# EAGLE schematic attiny_rc_switch_schematic (EAGLE 9.7.0)
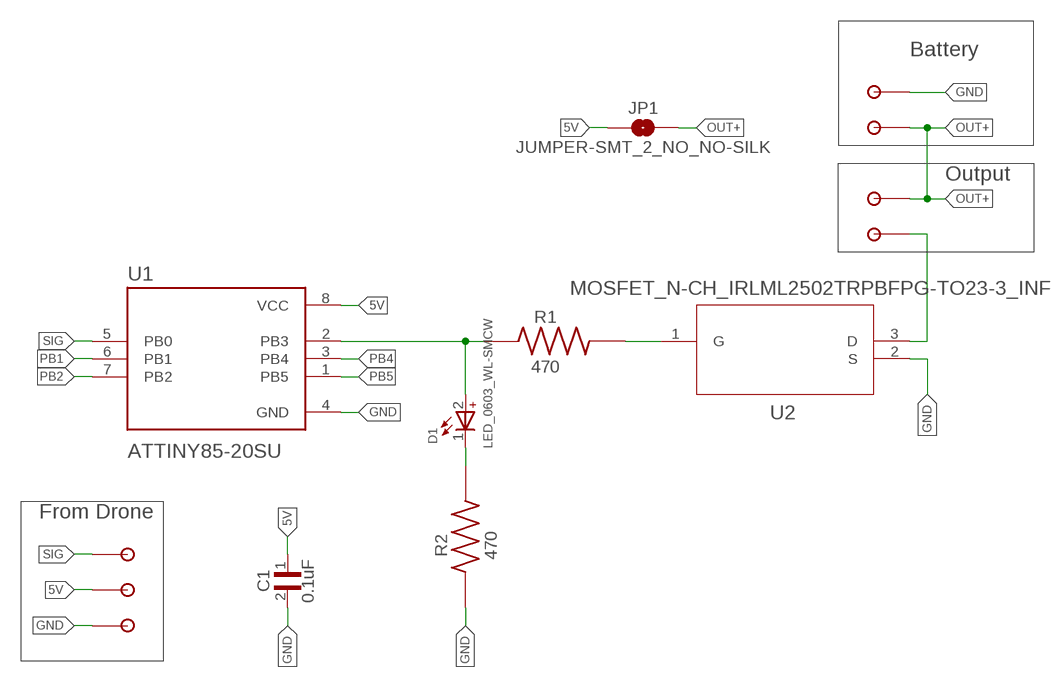
[diagram p0: schematic, sheet 1]

## Parts
C1  0.1uF  CAPACITOR_CERAMIC_0603_50V_CC0603ZRY5V9BB  [CC0603ZRY5V9BB]
D1  LED_0603_WL-SMCW  [LED_0603_WL-SMCW]
JP1  JUMPER-SMT_2_NO_NO-SILK  [SMT-JUMPER_2_NO_NO-SILK]
R1  470  RESISTOR_0603_1/4W_RCS0603  [RCS0603]
R2  470  RESISTOR_0603_1/4W_RCS0603  [RCS0603]
U1  ATTINY85-20SU  [ATTINY85-20SU]
U2  MOSFET_N-CH_IRLML2502TRPBFPG-TO23-3_INF  [MOSFET_N-CH_IRLML2502TRPBF]
U$1  SMD_PAD_NO_STENCIL  [SMD_PAD_NO_STENCIL]
U$2  SMD_PAD_NO_STENCIL  [SMD_PAD_NO_STENCIL]
U$3  SMD_PAD_NO_STENCIL  [SMD_PAD_NO_STENCIL]
U$4  SMD_PAD_NO_STENCIL  [SMD_PAD_NO_STENCIL]
U$5  SMD_PAD_NO_STENCIL  [SMD_PAD_NO_STENCIL]
U$6  SMD_PAD_NO_STENCIL  [SMD_PAD_NO_STENCIL]
U$7  SMD_PAD_NO_STENCIL  [SMD_PAD_NO_STENCIL]

## Nets
5V: C1.1 JP1.1 U1.8(VCC) U$2.P$1
GND: C1.2 R2.1 U1.4(GND) U2.2(S) U$6.P$1 U$7.P$1
N$1: D1.2(+) R1.1 U1.2(PB3)
N$2: R1.2 U2.1(G)
N$3: D1.1(-) R2.2
OUT+: JP1.2 U$4.P$1 U$5.P$1
OUT-: U2.3(D) U$3.P$1
PB1: U1.6(PB1)
PB2: U1.7(PB2)
PB4: U1.3(PB4)
PB5: U1.1(PB5)
SIG: U1.5(PB0) U$1.P$1

## Notes on the sheet
- Battery
- Output
- From Drone

## Library data of the parts
C1 = scotts-library:CAPACITOR_CERAMIC_0603_50V_CC0603ZRY5V9BB: Cap Ceramic 0.1uF 50V Y5V -20% to 80% Pad SMD 0603 85?C T/R
D1 = scotts-library:LED_0603_WL-SMCW: WL-SMCW SMT Mono-color Chip LED Waterclea Characteristics Low energy consumption High reliability Low current requirement Fast switching No UV/IR radiation Smallest SMD LED package for exceptional brightness Top view LED Wide viewing angle Better solder ability Heat dissipation Applications Backlight for mobile and portable device keypads Indoor and outdoor message boards Flat backlight for LCDs, switches and symbols Display for industrial control systems and traffic Miniaturized color effects Pedestrian mark Optical indicators Tabular backlight: LCD, telephone key-press, power-switch, display board Indoor displays Signals Identifiers Backlight for automobile DVD LED General lighting Toys <https://www.we-online.com/catalog/media/o14904v209%20Family_WL-SMCW.jpg> Details see: www.we-online.com/catalog/WL-SMCW <www.we-online.com/catalog/WL-SMCW/?utm_source=eagle_model&utm_medium=description_link&utm_campaign=eisos_eagle> Updated by Ella Wu, 2022-06-16 2022(C) Wurth Elektronik
JP1 = SparkFun-Jumpers:JUMPER-SMT_2_NO: Normally open jumper This jumper has two pads in close proximity to each other. Apply solder to close the connection. Round pads are easier to solder for beginners, but are a lot larger. SparkFun Product that uses the round pads: SparkFun EL Sequencer <https://www.sparkfun.com/products/12781>
R1 R2 = scotts-library:RESISTOR_0603_1/4W_RCS0603: 10K OHM 5% 200PPM
U1 = scotts-library:ATTINY85-20SU: AVR AVR® ATtiny, Functional Safety (FuSa) Microcontroller IC 8-Bit 20MHz 8KB (4K x 16) FLASH 8-SOIC; AVAILABILITY: Good; DESCRIPTION: IC MCU 8BIT 8KB FLASH 8SOIC; MAXIMUM_PACKAGE_HEIGHT: 2.16 mm; MF: Microchip Technology; MP: ATTINY85V-10SU; PACKAGE: None; PARTREV: 2586Q–AVR–08/2013; PRICE: None; PURCHASE-URL: https://pricing.snapeda.com/search/part/ATTINY85V-10SU/?ref=eda
U2 = scotts-library:MOSFET_N-CH_IRLML2502TRPBF; COPYRIGHT: Copyright (C) 2024 Ultra Librarian. All rights reserved.; MANUFACTURER_PART_NUMBER: IRLML2502TRPBF; MFR_NAME: Infineon
U$1-U$7 = scotts-library:SMD_PAD_NO_STENCIL